# EAGLE design GPduinoWiFi (EAGLE 6.5.0)
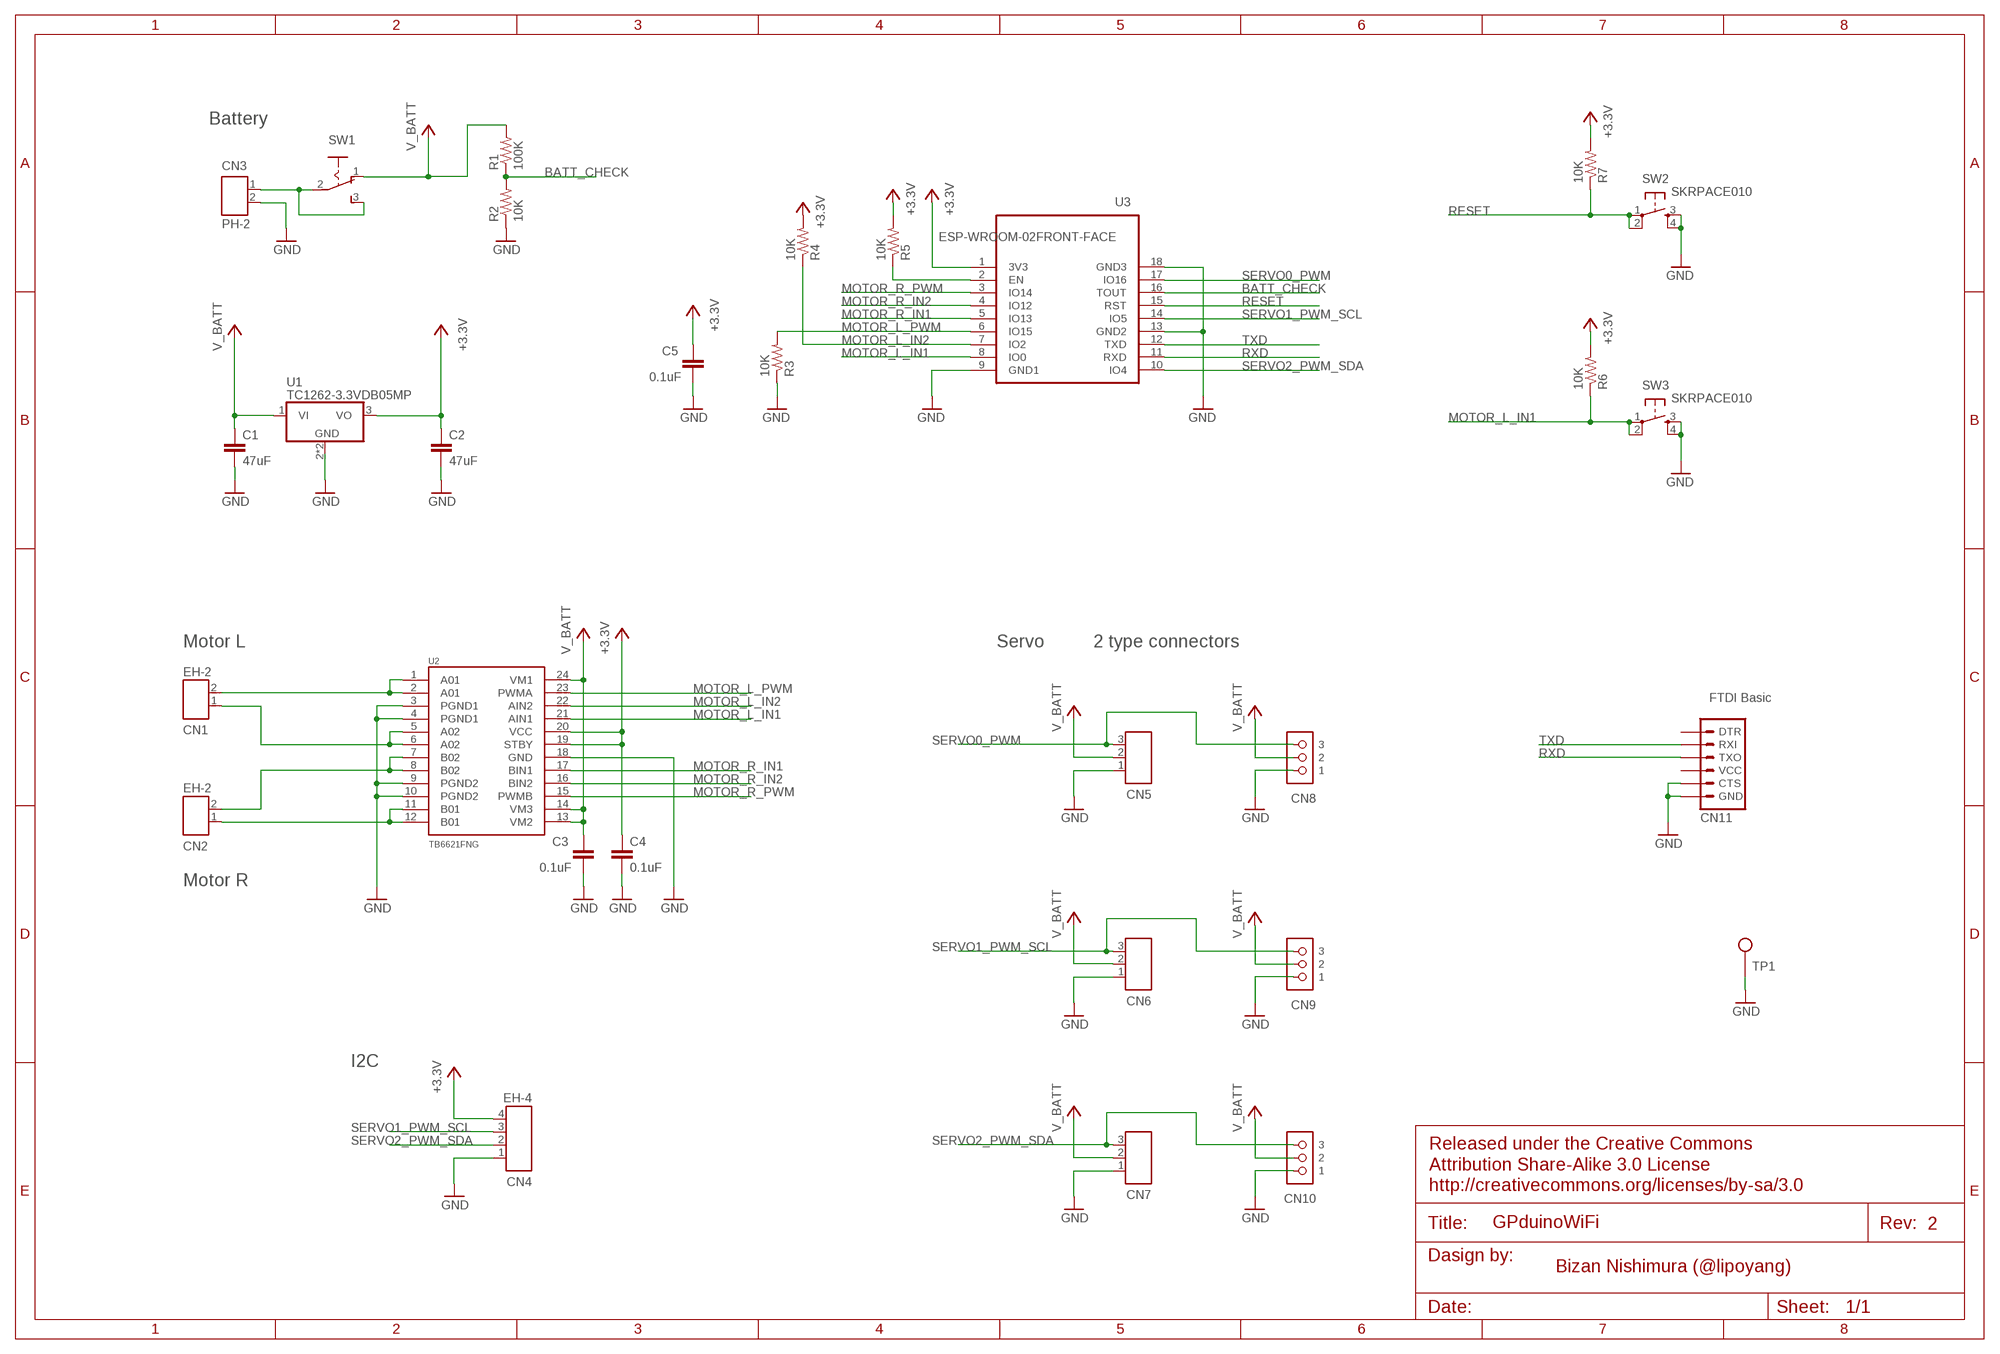
[diagram p0: schematic, sheet 1]

## Parts
C1  47uF  C-EUC3216  [C3216]
C2  47uF  C-EUC3216  [C3216]
C3  0.1uF  C-EUC1608  [C1608]
C4  0.1uF  C-EUC1608  [C1608]
C5  0.1uF  C-EUC1608  [C1608]
CN1  EH-2  [EH-2]
CN2  EH-2  [EH-2]
CN3  PH-2  [PH-2]
CN4  EH-4  [EH-4]
CN5  PICOBLADE-3  [PICOBLADE-3]
CN6  PICOBLADE-3  [PICOBLADE-3]
CN7  PICOBLADE-3  [PICOBLADE-3]
CN8  cn6  PINHD-1X3  [CON_RC_SERVO]
CN9  cn6  PINHD-1X3  [CON_RC_SERVO]
CN10  cn6  PINHD-1X3  [CON_RC_SERVO]
CN11  FTDI Basic  ARDUINO_SERIAL_PROGRAMPTH  [1X06]
R1  100K  RESISTOR0603-RES  [0603-RES]
R2  10K  RESISTOR0603-RES  [0603-RES]
R3  10K  RESISTOR0603-RES  [0603-RES]
R4  10K  RESISTOR0603-RES  [0603-RES]
R5  10K  RESISTOR0603-RES  [0603-RES]
R6  10K  RESISTOR0603-RES  [0603-RES]
R7  10K  RESISTOR0603-RES  [0603-RES]
SW1  SW1  M251  [SLIDE-SW]
SW2  SKRPACE010  [SKRPACE010]
SW3  SKRPACE010  [SKRPACE010]
TP1  TEST_PIN  [TEST_PIN]
U1  TC1262-3.3VDB05MP  [SOT223]
U2  TB6621FNG  [SSOP24]
U3  ESP-WROOM-02FRONT-FACE  [FRONT-FACE]

## Nets
+3V3: C2.1 C4.1 C5.1 CN4.4 R4.2 R5.2 R6.2 R7.2 U1.3(VO) U2.19(STBY) U2.20(VCC) U3.1(3V3) ; supply symbol labelled +3.3V
A01: CN1.2 U2.1(A01) U2.2(A01)
A02: CN1.1 U2.5(A02) U2.6(A02)
BATT_CHECK: R1.1 R2.2 U3.16(TOUT)
GND: C1.2 C2.2 C3.2 C4.2 C5.2 CN3.2 CN4.1 CN5.1 CN6.1 CN7.1 CN8.1 CN9.1 CN10.1 CN11.5(CTS) CN11.6(GND) R2.1 R3.1 SW2.3 SW2.4 SW3.3 SW3.4 TP1.1 U1.2(GND) U1.4(GND) U2.3(PGND1) U2.4(PGND1) U2.9(PGND2) U2.10(PGND2) U2.18(GND) U3.9(GND1) U3.13(GND2) U3.18(GND3)
MOTOR_L_IN1: R6.1 SW3.1 SW3.2 U2.21(AIN1) U3.8(IO0)
MOTOR_L_IN2: R4.1 U2.22(AIN2) U3.7(IO2)
MOTOR_L_PWM: R3.2 U2.23(PWMA) U3.6(IO15)
MOTOR_R_IN1: U2.17(BIN1) U3.5(IO13)
MOTOR_R_IN2: U2.16(BIN2) U3.4(IO12)
MOTOR_R_PWM: U2.15(PWMB) U3.3(IO14)
N$1: CN3.1 SW1.2(P) SW1.3(S)
N$2: R5.1 U3.2(EN)
N$5: CN2.1 U2.11(B01) U2.12(B01)
N$6: CN2.2 U2.7(B02) U2.8(B02)
RESET: R7.1 SW2.1 SW2.2 U3.15(RST)
RXD: CN11.3(TXO) U3.11(RXD)
SERVO0_PWM: CN5.3 CN8.3 U3.17(IO16)
SERVO1_PWM_SCL: CN4.3 CN6.3 CN9.3 U3.14(IO5)
SERVO2_PWM_SDA: CN4.2 CN7.3 CN10.3 U3.10(IO4)
TXD: CN11.2(RXI) U3.12(TXD)
V_BATT: C1.1 C3.1 CN5.2 CN6.2 CN7.2 CN8.2 CN9.2 CN10.2 R1.2 SW1.1(O) U1.1(VI) U2.13(VM2) U2.14(VM3) U2.24(VM1)
Unconnected: CN11.1(DTR) CN11.4(VCC)

## Notes on the sheet
- Battery
- Motor L | Servo | 2 type connectors
- Motor R
- I2C
- 2
- Bizan Nishimura (@lipoyang)

## Library data of the parts
C1-C5 = resistor:C-EU: CAPACITOR, European symbol
CN1 CN2 = lipoyang_mechanical:EH-2
CN3 = lipoyang_mechanical:PH-2
CN4 = lipoyang_mechanical:EH-4
CN5-CN7 = lipoyang_mechanical:PICOBLADE-3
CN8-CN10 = lipoyang_mechanical:PINHD-1X3: PIN HEADER
CN11 = SparkFun:ARDUINO_SERIAL_PROGRAM
R1-R7 = SparkFun:RESISTOR: Resistor Basic schematic elements and footprints for 0603, 1206, and PTH resistors.
SW1 = pendolino:M251: SLIDING SWITCH Mors, distributor Buerklin, 11G702
SW2 SW3 = lipoyang_mechanical:SKRPACE010
TP1 = lipoyang:TEST_PIN: Test Pin
U1 = lipoyang:TC1262-3.3VDB: Positive VOLTAGE REGULATOR Source: http://cache.national.com/ds/LM/LM340.pdf
U2 = SparkFun:TB6621FNG: Toshiba 1A motor driver
U3 = esp-wroom-02:ESP-WROOM-02: WiFi module - ESP-WROOM-02

## Net classes
0 default: width 0.203 mm
1 vcc: width 0.254 mm

## Board
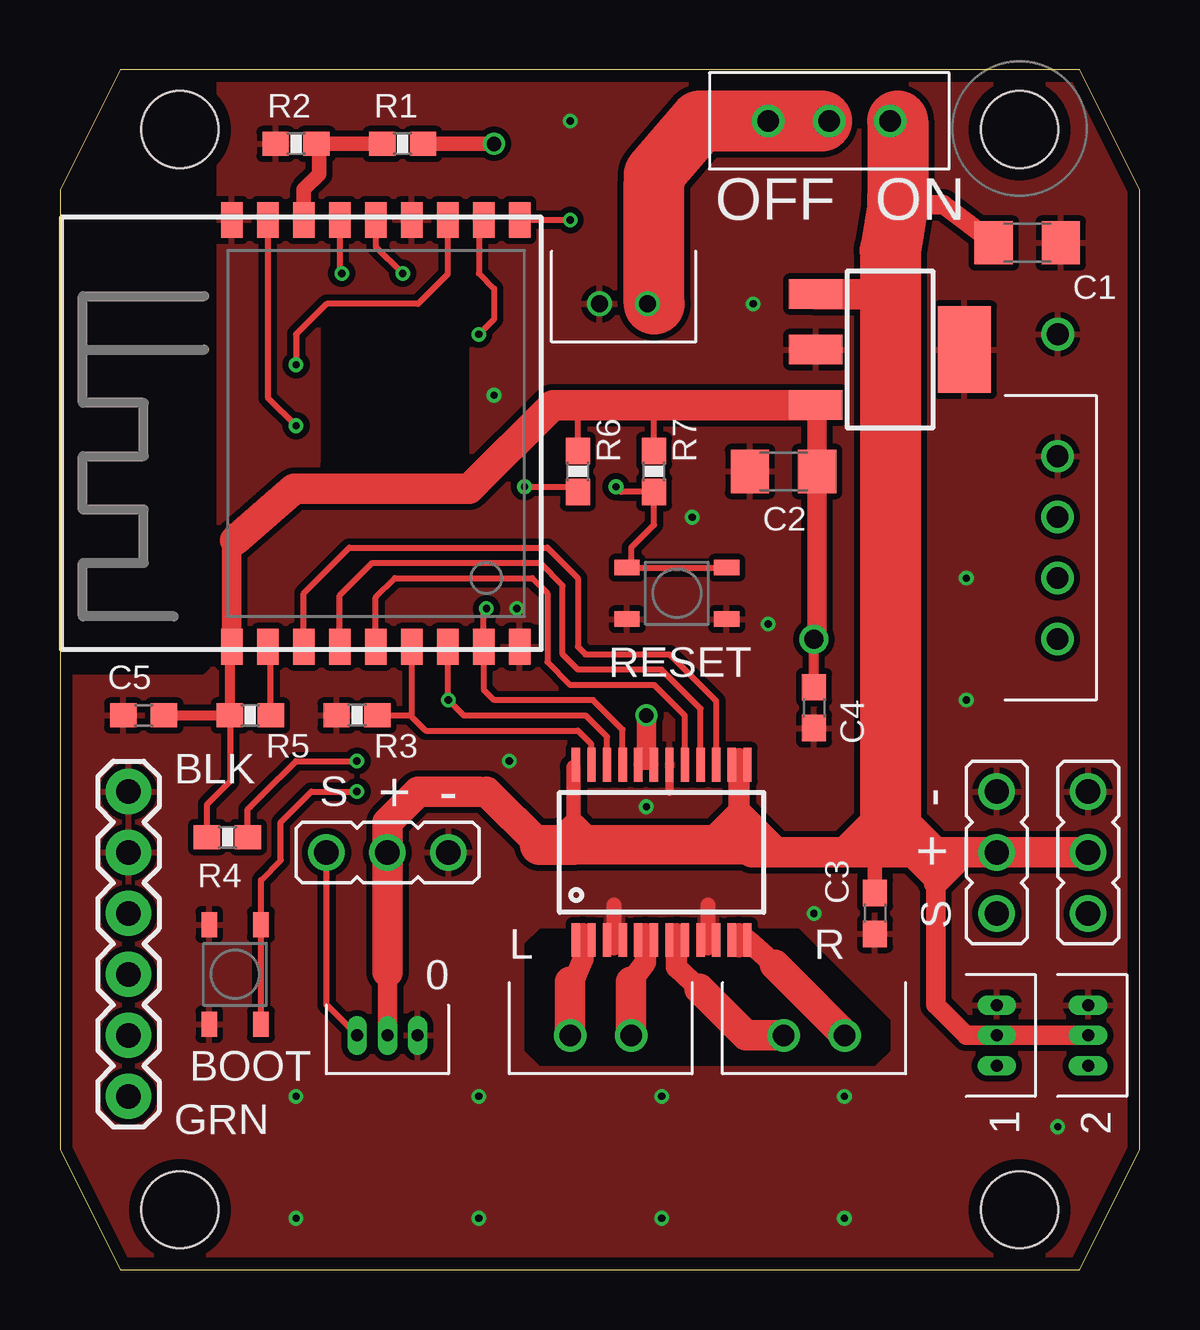
[diagram p1: board, top side]
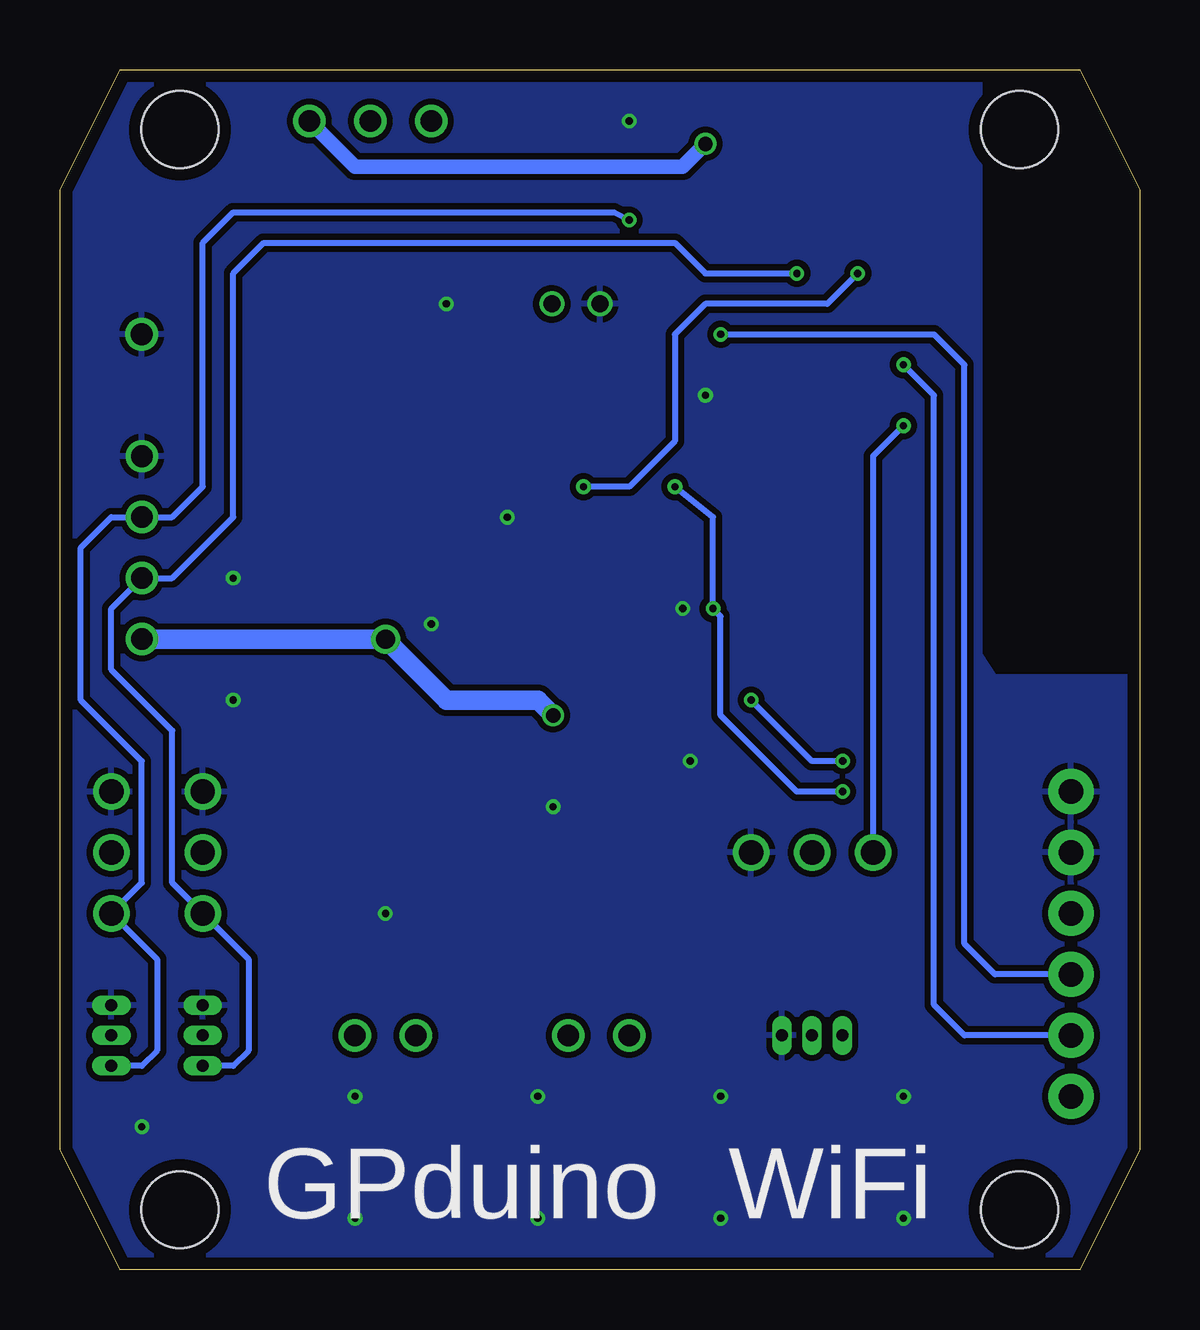
[diagram p2: board, bottom side, seen from below]

Size 45 x 50 mm. Coordinates in mm from the lower left corner, seen from the top.
Outline: 2.5,0 42.5,0 45,5 45,45 42.5,50 2.5,50 0,45 0,5 2.5,0
Copper layers (1*16): Top 0.035mm / dielectric 1.6mm / Bottom 0.035mm
Design rules "Elecrow_2-layer_PCB_eagle_rule": minimum track width 6mil, minimum drill 12mil, track to track 6mil, track to pad 6mil, pad to pad 6mil, via to via 8mil, smd to smd 0mil, copper to edge 20mil, drill to drill 10mil, minimum pad ring 6mil, minimum via ring 6mil, stop-mask expansion 0mil, vias tented up to drill 100mil, thermal gap 10mil
Holes 3.2 mm at 5,47.5 40,47.5 5,2.5 40,2.5

### Footprints (pad centres in the part's own frame; a part is rotated, then mirrored left to right if it is on the bottom)
C3216 = smd 1.6 x 1.8: 1 -1.4,0; 2 1.4,0
C1608 = smd 1.1 x 1: 1 -0.85,0; 2 0.85,0
EH-2 = drill 0.9: 1 -1.27,0; 2 1.27,0
PH-2 = drill 0.7: 1 -1,0; 2 1,0
EH-4 = drill 0.9: 1 -3.81,0; 2 -1.27,0; 3 1.27,0; 4 3.81,0
PICOBLADE-3 = drill 0.5 long: 1 -1.25,0; 2 0,0; 3 1.27,0
CON_RC_SERVO = drill 1.016: 1 -2.54,0; 2 0,0; 3 2.54,0
1X06 = drill 1.016 pad 1.88: 1 0,0; 2 2.54,0; 3 5.08,0; 4 7.62,0; 5 10.16,0; 6 12.7,0
0603-RES = smd 1.1 x 1: 1 -0.85,0; 2 0.85,0
SLIDE-SW = drill 0.9: 1 -2.54,0; 2 0,0; 3 2.54,0
SKRPACE010 = smd 1.05 x 0.65: 1 -2.075,1.075; 2 2.075,1.075; 3 -2.075,-1.075; 4 2.075,-1.075
TEST_PIN = drill 0.914: 1 0,0
SOT223 = smd 1.219 x 2.235: 1 -2.311,-3.099; 2 0,-3.099; 3 2.311,-3.099 | smd 3.6 x 2.2: 4 0,3.099
SSOP24 = smd 0.348 x 1.397: 1 -3.575,-3.656; 2 -2.925,-3.656; 3 -2.275,-3.656; 4 -1.625,-3.656; 5 -0.975,-3.656; 6 -0.325,-3.656; 7 0.325,-3.656; 8 0.975,-3.656; 9 1.625,-3.656; 10 2.275,-3.656; 11 2.925,-3.656; 12 3.575,-3.656; 13 3.575,3.656; 14 2.925,3.656; 15 2.275,3.656; 16 1.625,3.656; 17 0.975,3.656; 18 0.325,3.656; 19 -0.325,3.656; 20 -0.975,3.656; 21 -1.625,3.656; 22 -2.275,3.656; 23 -2.925,3.656; 24 -3.575,3.656
FRONT-FACE = smd 1.485 x 0.9: 1 -8.893,4.9; 2 -8.893,3.4; 3 -8.893,1.9; 4 -8.893,0.4; 5 -8.893,-1.1; 6 -8.893,-2.6; 7 -8.893,-4.1; 8 -8.893,-5.6; 9 -8.893,-7.1; 10 8.893,-7.1; 11 8.893,-5.6; 12 8.893,-4.1; 13 8.893,-2.6; 14 8.893,-1.1; 15 8.893,0.4; 16 8.893,1.9; 17 8.893,3.4; 18 8.893,4.9

### Placement (x,y rotation side)
C1  40.32,42.78 0 top
C2  30.16,33.26 180 top
C3  33.97,14.84 270 top
C4  31.43,23.41 270 top
C5  3.49,23.1 180 top
CN1  22.54,9.76 180 top
CN2  31.43,9.76 180 top
CN3  23.49,40.24 180 top
CN4  41.59,30.08 270 top
CN5  13.65,9.76 180 top
CN6  39.05,9.76 270 top
CN7  42.86,9.76 270 top
CN8  13.65,17.38 180 top
CN9  39.05,17.38 270 top
CN10  42.86,17.38 270 top
CN11  2.86,7.22 90 top
R1  14.28,46.91 0 top
R2  9.84,46.91 0 top
R3  12.38,23.1 0 top
R4  6.98,18.02 180 top
R5  7.94,23.1 180 top
R6  21.59,33.26 90 top
R7  24.76,33.26 90 top
SW1  32.07,47.86 180 top
SW2  25.71,28.18 0 top
SW3  7.3,12.3 270 top
TP1  41.59,38.97 0 top
U1  34.61,38.34 270 top
U2  25.08,17.38 0 top
U3  12.06,34.84 90 top

### Tracks (layer width: path | path; a pad name or v marks a point on that pad's centre or on a via)
+3V3  (via drill 0.6, 0.8)
  Top 0.254: 7.08,25.87 U3.1 | R5.2 7.08,20.34 6.13,19.39 R4.2 | 21.91,35.71 21.59,36.02 R6.2 | R7.2 24.76,35.71 24.45,36.02
  Top 0.406: U2.20 U2.19 24.45,21.35 24.45,21.83 | 7.08,25.87 R5.2 C5.1 | C4.1 v31.43,26.27
  Top 0.813: U1.3 31.56,35.97 C2.1 31.56,26.4 v31.43,26.27 | v24.45,23.1 24.45,21.83 | U3.1 7.16,30.26 7.3,30.4
  Top 1.27: U1.3 24.45,36.02 21.59,36.02 20.55,36.02 17.05,32.53 9.75,32.53 7.3,30.4
  Bottom 0.813: v24.45,23.1 25.08,23.73 28.89,23.73 v31.43,26.27 CN4.4
A01
  Top 0.254: U2.1 21.8,14 U2.2
  Top 0.406: 21.51,12.23 21.27,12
  Top 0.9: 21.8,14 21.8,12.93 21.51,12.23
  Top 1.27: 21.27,12 CN1.2
A02
  Top 0.254: U2.5 24.4,14 U2.6
  Top 0.9: 24.4,14 24.4,12.8 23.81,12
  Top 1.27: 23.81,12 CN1.1
BATT_CHECK
  Top 0.406: 10.79,46.8 R2.2
  Top 0.61: U3.16 10.16,45.01 10.79,45.64 10.79,46.8 | R2.2 R1.1
GND  (via drill 0.3)
  Top 0.254: U2.3 23.1,13.4 | U2.9 27,13.4
  Top 0.35: 25.4,20.55 25.4,19.92
  Top 0.406: CN5.1 14.92,9.76
  Top 0.61: 23.1,13.4 23.1,15.2 | 27,13.4 27,15.2
  other vias: 24.45,19.29 9.84,2.14 9.84,7.22 25.08,2.14 32.7,2.14 17.46,7.22 25.08,7.22 32.7,7.22 41.59,5.95 17.46,2.14 31.43,14.84 19.05,27.54 18.73,21.19 26.35,31.35 29.52,26.91 37.78,28.81 28.89,40.24 18.09,36.43 21.27,47.86 37.78,23.73
  pour Top (isolate 0.254, rank 2): -0.32,24.68 6.03,24.68 6.66,25.32 6.66,50.4 45.4,50.4 45.4,-0.4 -0.32,-0.4
  pour Bottom (isolate 0.254): -0.96,24.68 6.03,24.68 6.66,25.64 6.66,51.35 46.04,51.04 46.04,-0.4 -0.96,-0.4
MOTOR_L_IN1  (via drill 0.3)
  Top 0.254: U2.21 23.45,22.5 22.22,23.73 18.09,23.73 17.66,24.16 U3.8 17.66,27.43 v17.78,27.54 | v19.37,32.62 21.37,32.62 R6.1 | SW3.2 SW3.1 8.38,16.23 9.21,17.06 9.21,18.65 10.47,19.92 v12.38,19.92
  Bottom 0.254: v19.37,32.62 17.78,31.35 v17.78,27.54 17.46,27.22 17.46,23.1 14.28,19.92 v12.38,19.92
MOTOR_L_IN2  (via drill 0.3)
  Top 0.254: U3.7 16.16,23.76 v16.19,23.73 16.83,23.1 21.91,23.1 22.8,22.2 U2.22 | v12.38,21.19 9.84,21.19 8.41,19.76 7.94,19.29 7.83,19.18 R4.1
  Bottom 0.254: v12.38,21.19 13.65,21.19 v16.19,23.73
MOTOR_L_PWM
  Top 0.254: U2.23 22.16,21.89 21.59,22.46 15.24,22.46 14.66,23.04 | U3.6 14.66,23.04 | R3.2 14.6,23.1 14.66,23.04
MOTOR_R_IN1
  Top 0.254: U3.5 13.16,28.01 13.97,28.81 19.68,28.81 20.32,28.18 20.32,25.32 21.27,24.37 24.76,24.37 26.03,23.1 26.03,21.06 U2.17
MOTOR_R_IN2
  Top 0.254: U2.16 26.7,23.38 25.08,25 21.59,25 20.95,25.64 20.95,28.49 20,29.45 13.01,29.45 11.66,28.09 U3.4
MOTOR_R_PWM
  Top 0.254: U3.3 10.16,28.18 12.06,30.08 20.32,30.08 21.59,28.81 21.59,25.95 21.91,25.64 25.4,25.64 27.36,23.68 U2.15
N$1
  Top 0.406: CN3.1 24.76,40.24 | 24.76,45.64 24.76,45.32 25.4,45.32 27.3,47.54 | 31.75,47.86 SW1.2
  Top 1.27: CN3.1 24.49,45.37 24.76,45.64 26.98,47.86
  Top 2.54: 26.98,47.86 SW1.3 31.75,47.86 | 24.76,40.24 24.76,45.32 | 24.76,45.64 26.67,47.86
N$2
  Top 0.254: R5.1 8.79,25.83 U3.2
N$5
  Top 0.254: U2.12 28.3,14 | 28.3,13.45 U2.11
  Top 0.9: 28.3,14 28.3,13.45 | 29.8,12.7 U2.12
  Top 1.27: CN2.1 32.7,9.8 29.8,12.7
N$6
  Top 0.254: U2.7 25.7,14 U2.8
  Top 0.9: 25.7,14 25.7,12.6 26.66,11.7
  Top 1.27: 26.66,11.7 28.59,9.76 CN2.2
N$7
  cutout Top: 19.37,13.57 19.37,9.12 20,8.49 33.97,8.49 34.61,9.12 34.61,10.39 30.8,14.21 20,14.21
RESET  (via drill 0.3)
  Top 0.254: U3.15 11.66,41.59 v11.74,41.51 | v23.17,32.62 23.39,32.41 R7.1 24.76,31.03 23.81,30.08 23.81,29.42 SW2.1 SW2.2
  Bottom 0.254: v11.74,41.51 13.01,40.24 18.09,40.24 19.37,38.97 19.37,34.52 21.27,32.62 v23.17,32.62
RXD  (via drill 0.3)
  Top 0.254: U3.11 17.46,43.73 17.46,41.51 18.09,40.88 18.09,39.61 v17.46,38.97
  Bottom 0.254: CN11.3 6.03,12.3 7.3,13.57 7.3,37.7 8.57,38.97 v17.46,38.97
SERVO0_PWM  (via drill 0.3)
  Top 0.254: CN5.3 11.11,11.03 CN8.3 | U3.17 8.66,36.34 v9.84,35.16
  Bottom 0.254: v9.84,35.16 11.11,33.89 CN8.3
SERVO1_PWM_SCL  (via drill 0.3)
  Top 0.254: U3.14 13.16,42.61 v14.28,41.51
  Bottom 0.254: CN6.3 37.78,8.49 37.15,9.12 37.15,12.94 CN9.3 40.32,16.11 40.32,22.46 42.86,25 42.86,27.54 CN4.3 40.32,28.81 37.78,31.35 37.78,41.51 36.51,42.78 19.37,42.78 18.09,41.51 v14.28,41.51
SERVO2_PWM_SDA  (via drill 0.3)
  Top 0.254: U3.10 v21.27,43.73
  Bottom 0.254: CN7.3 41.59,8.49 40.95,9.12 40.95,12.94 CN10.3 41.59,16.11 41.59,21.19 44.13,23.73 44.13,30.08 42.86,31.35 CN4.2 40.32,31.35 39.05,32.62 39.05,42.78 37.78,44.05 21.91,44.05 v21.27,43.73
TXD  (via drill 0.3)
  Top 0.254: U3.12 16.16,41.48 14.92,40.24 11.11,40.24 9.84,38.97 v9.84,37.7
  Bottom 0.254: CN11.2 7.3,9.76 8.57,11.03 8.57,36.43 v9.84,37.7
V_BATT  (via drill 0.6)
  Top 0.254: U2.14 28.01,21.11 28.3,21.4 28.3,21.29 U2.13 | 28.3,18.21 28.5,17.71 | U2.24 21.4,20.94
  Top 0.406: 34.92,44.37 34.92,44.69 | 17.46,19.92 17.78,19.92 | 21.4,17.7 21.4,18.4 | 34.61,18.33 34.92,18.33 35.4,18.81
  Top 0.61: 21.4,20.94 21.4,18.65 | 21.4,18.65 21.4,18.4 | 26.98,18.02 28.26,19.29 | 20.95,18.33 21.27,18.65 21.4,18.65 | 21.4,18.65 21.59,18.65 21.91,18.33 | C3.1 33.97,17.38 | R1.2 v18.09,46.91
  Top 0.813: 13.65,12.4 CN5.2 | 28.26,19.29 30.16,17.38 | CN7.2 CN6.2 37.78,9.76 36.51,11.03 36.51,16.11 35.24,17.38 | C1.1 36.83,44.37 34.92,44.37 | 32.7,17.7 33.97,18.97 35.24,18.97 35.4,18.81 36.51,17.7
  Top 0.9: 28.3,21.29 28.3,18.21
  Top 1.016: 36.51,16.11 37.78,17.38
  Top 1.27: 13.65,12.4 CN8.2 13.65,18.65 14.92,19.92 17.46,19.92 | CN10.2 CN9.2 37.78,17.38 35.24,17.38 34.61,17.38 | 34.61,17.38 33.97,17.38 30.16,17.38 28.84,17.38 28.5,17.71 | SW1.1 34.92,44.37 | 34.61,18.33 34.61,17.38 | U1.1 34.06,40.65 34.61,40.88 | 17.78,19.92 20,17.7
  Top 1.676: 21.4,17.7 28.5,17.71 | 20,17.7 21.4,17.7
  Top 2.54: 34.92,44.37 34.61,42.46 34.61,40.88 34.61,18.33 | 34.92,47.86 34.92,44.69
  Bottom 0.61: v18.09,46.91 19.05,45.95 32.7,45.95 SW1.1

### Text on the board
tPlace: OFF | ON | RESET | BLK | S | - | + | - | + | S | L | R | 0 | BOOT | GRN | 1 | 2
bPlace: WiFi | GPduino